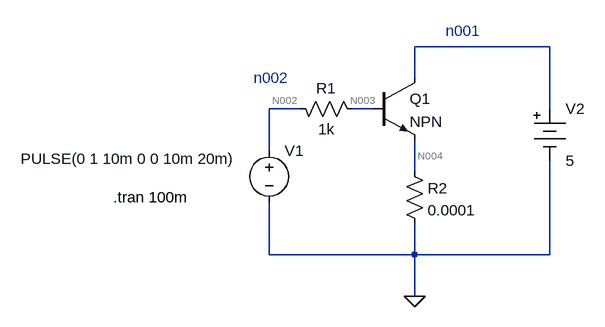
[diagram p0: schematic Yoneda-p98__Transistor_switching.asc]
Yoneda-p98__Transistor_switching.asc, the LTspice schematic file:
Version 4
SHEET 1 880 680
WIRE 496 -32 288 -32
WIRE 288 16 288 -32
WIRE 112 64 64 64
WIRE 224 64 192 64
WIRE 496 64 496 -32
WIRE 64 128 64 64
WIRE 288 160 288 112
WIRE 64 288 64 208
WIRE 288 288 288 240
WIRE 288 288 64 288
WIRE 496 288 496 144
WIRE 496 288 288 288
WIRE 288 352 288 288
FLAG 288 352 0
SYMBOL res 208 80 M270
WINDOW 0 32 56 VTop 2
WINDOW 3 0 56 VBottom 2
SYMATTR InstName R1
SYMATTR Value 1k
SYMBOL res 272 144 R0
WINDOW 0 36 42 Left 2
SYMATTR InstName R2
SYMATTR Value 0.0001
SYMBOL Misc\\battery 496 48 R0
SYMATTR InstName V2
SYMATTR Value 5
SYMBOL npn 224 16 R0
SYMATTR InstName Q1
SYMBOL voltage 64 112 R0
WINDOW 3 -382 29 Left 2
WINDOW 123 0 0 Left 2
WINDOW 39 0 0 Left 2
SYMATTR Value PULSE(0 1 10m 0 0 10m 20m)
SYMATTR InstName V1
TEXT -176 200 Left 2 !.tran 100m
TEXT 40 16 Left 2 ;n002
TEXT 336 -56 Left 2 ;n001

The netlist it stands for:
* Yoneda-p98__Transistor_switching.asc
R1 N003 N002 1k
R2 N004 0 0.0001
V2 N001 0 5
Q1 N001 N003 N004 0 NPN
V1 N002 0 PULSE(0 1 10m 0 0 10m 20m)
.model NPN NPN
.model PNP PNP
.lib standard.bjt
.tran 100m
* n002
* n001
.backanno
.end

* Results of the author's LTspice run, read from the files saved beside the schematic
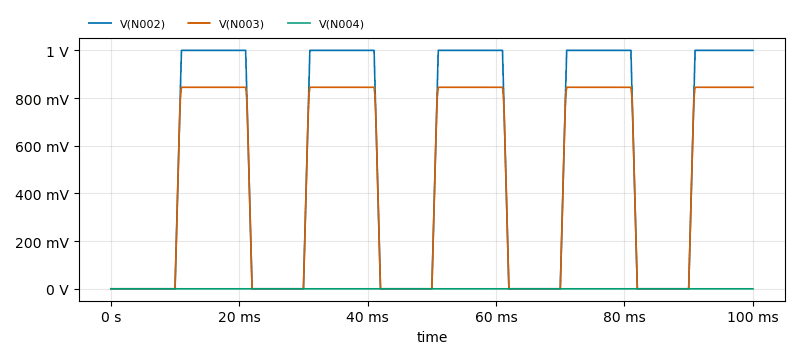
[diagram p1: Transient Analysis of Yoneda-p98__Transistor_switching.asc, plotted from the saved traces]
* Transient Analysis, 1 run:
*   V(N002): min 0 V, max 1 V, average 535 mV, rms 721.5 mV, last 1 V
*   V(N003): min 0 V, max 845.2 mV, average 457.5 mV, rms 614.6 mV, last 845.1 mV
*   V(N004): min 0 V, max 1.564 µV, average 782.9 nV, rms 1.102 µV, last 1.564 µV